# Altium schematic sheet FaultCircuit.SchDoc
size B; DrawnBy: MYazici
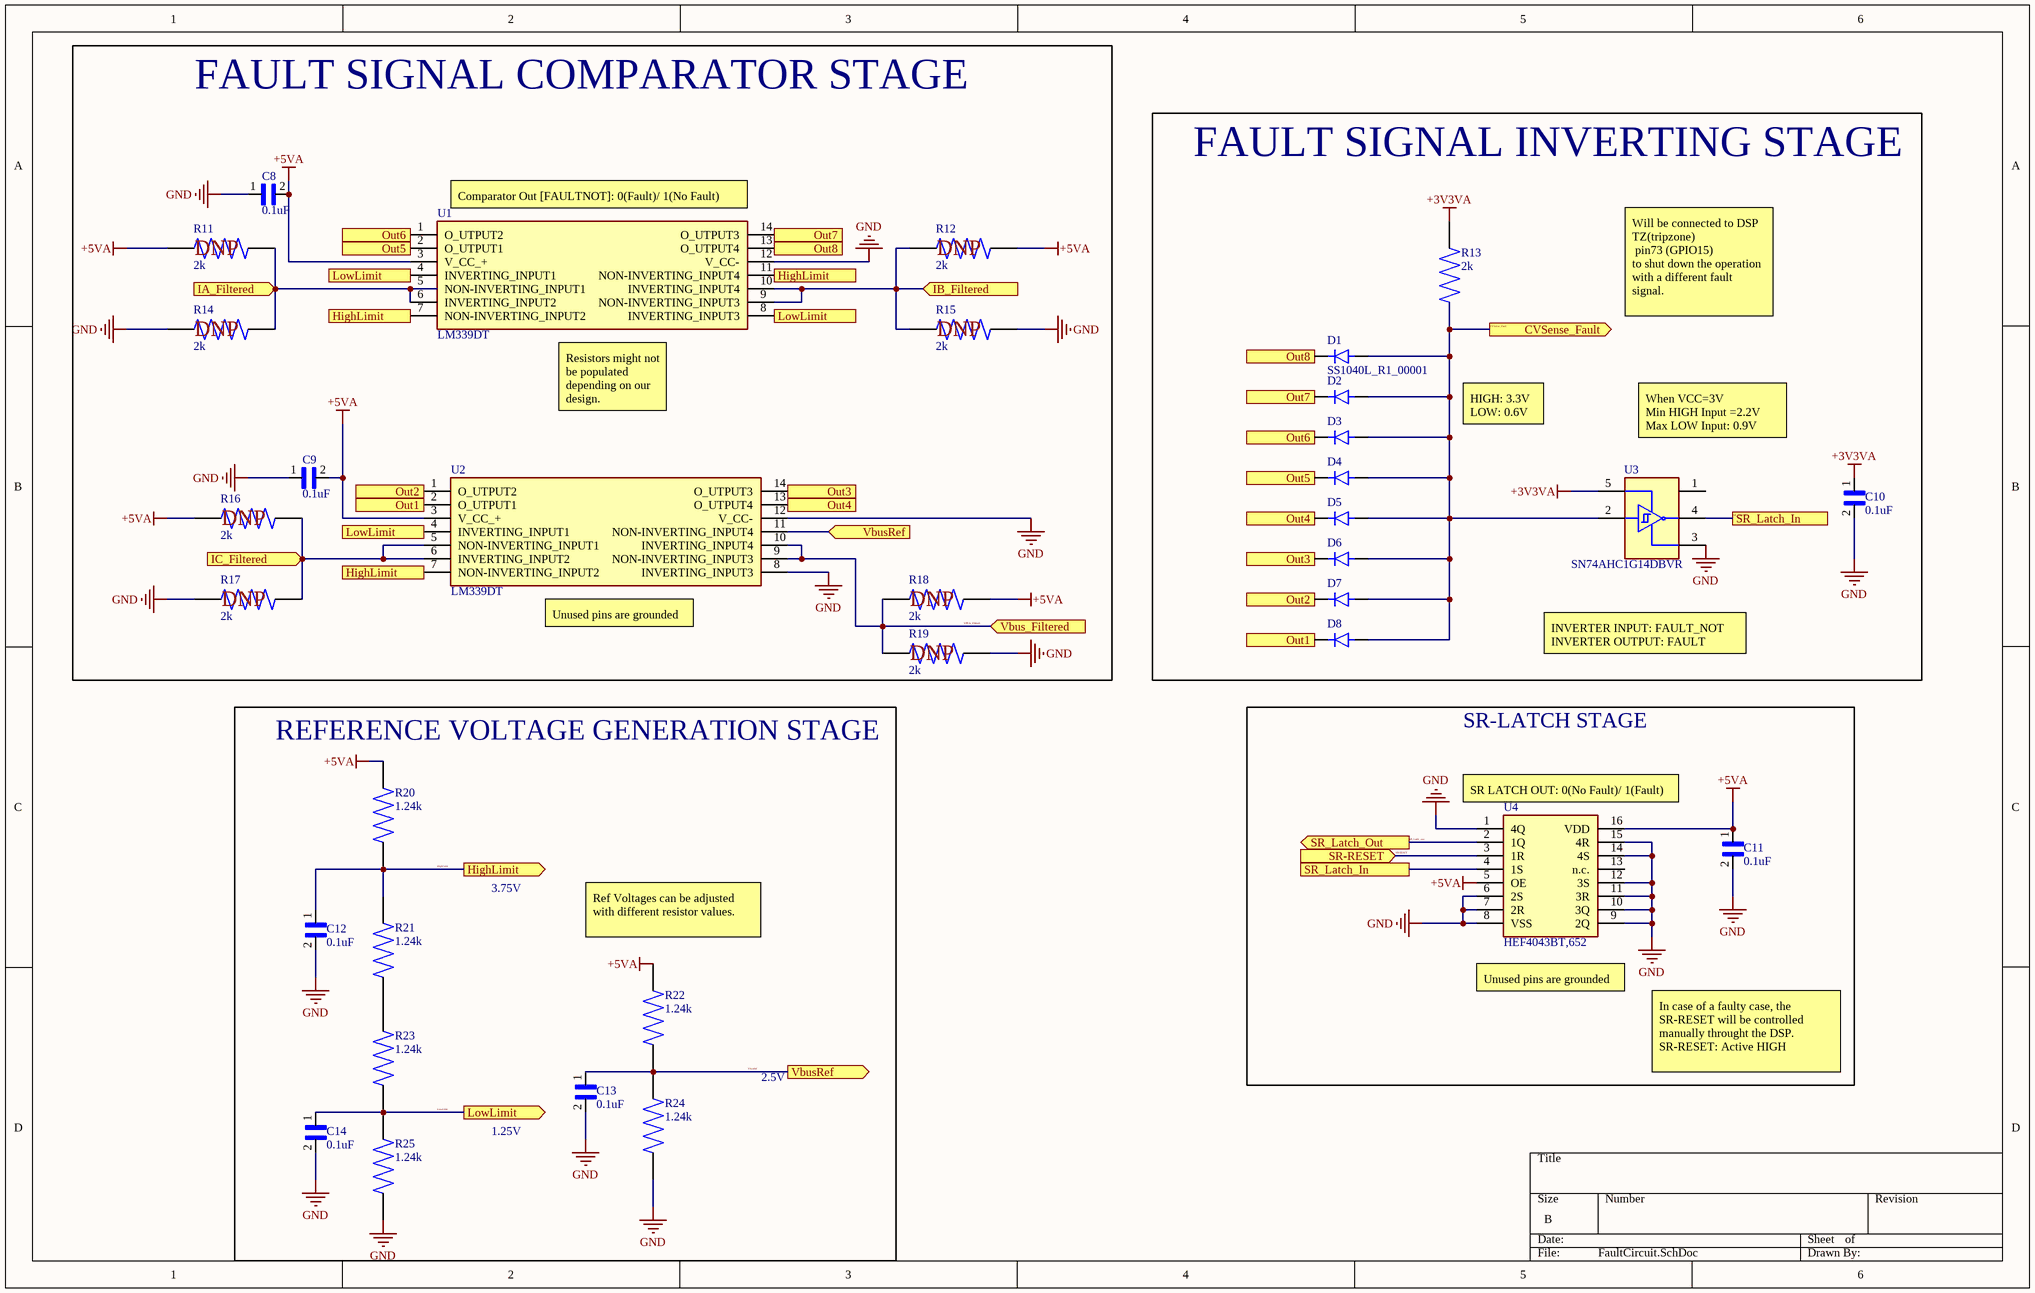
[diagram p0: FaultCircuit.SchDoc]

## Parts
C8  0.1uF  [CAP 0805(2012 metric)]
C9  0.1uF  [CAP 0805(2012 metric)]
C10  0.1uF  [CAP 0805(2012 metric)]
C11  0.1uF  [CAP 0805(2012 metric)]
C12  0.1uF  [CAP 0805(2012 metric)]
C13  0.1uF  [CAP 0805(2012 metric)]
C14  0.1uF  [CAP 0805(2012 metric)]
D1  SS1040L_R1_00001  [SOD123]
D2  SS1040L_R1_00001  [SOD123]  (value not drawn)
D3  SS1040L_R1_00001  [SOD123]  (value not drawn)
D4  SS1040L_R1_00001  [SOD123]  (value not drawn)
D5  SS1040L_R1_00001  [SOD123]  (value not drawn)
D6  SS1040L_R1_00001  [SOD123]  (value not drawn)
D7  SS1040L_R1_00001  [SOD123]  (value not drawn)
D8  SS1040L_R1_00001  [SOD123]  (value not drawn)
R11  2k  [RES 0805(2012 metric)]
R12  2k  [RES 0805(2012 metric)]
R13  2k  [RES 0805(2012 metric)]
R14  2k  [RES 0805(2012 metric)]
R15  2k  [RES 0805(2012 metric)]
R16  2k  [RES 0805(2012 metric)]
R17  2k  [RES 0805(2012 metric)]
R18  2k  [RES 0805(2012 metric)]
R19  2k  [RES 0805(2012 metric)]
R20  1.24k  [RES 0805(2012 metric)]
R21  1.24k  [RES 0805(2012 metric)]
R22  1.24k  [RES 0805(2012 metric)]
R23  1.24k  [RES 0805(2012 metric)]
R24  1.24k  [RES 0805(2012 metric)]
R25  1.24k  [RES 0805(2012 metric)]
U1  LM339DT  [SOIC127P600X175-14N]
U2  LM339DT  [SOIC127P600X175-14N]
U3  SN74AHC1G14DBVR  [SN74AHC1G14DBVR]
U4  HEF4043BT,652  [SOIC127P600X175-16N]

## Blocks framed on the sheet
FAULT SIGNAL COMPARATOR STAGE: C8 C9 R11 R12 R14-R19 U1 U2
FAULT SIGNAL INVERTING STAGE: C10 D1-D8 R13 U3
REFERENCE VOLTAGE GENERATION STAGE: C12-C14 R20-R25
SR-LATCH STAGE: C11 U4

## Ports
CVSense_Fault (out), HighLimit (in), HighLimit (out), IA_Filtered (in), IB_Filtered (in), IC_Filtered (in), LowLimit (in), LowLimit (out), Out1 (in), Out1 (out), Out2 (in), Out2 (out), Out3 (in), Out3 (out), Out4 (in), Out4 (out), Out5 (in), Out5 (out), Out6 (in), Out6 (out), Out7 (in), Out7 (out), Out8 (in), Out8 (out), SR-RESET (in), SR_Latch_In, SR_Latch_Out (out), Vbus_Filtered (in), VbusRef (in), VbusRef (out)

## Nets
+3V3VA: C10.1 R13.2 U3.5(VCC)
+5VA: C8.2 C9.2 C11.1 R11.1 R12.2 R16.1 R18.2 R20.2 R22.2 U1.3(V_CC_+) U2.3(V_CC_+) U4.5(OE) U4.16(VDD)
GND: C8.1 C9.1 C10.2 C11.2 C12.2 C13.2 C14.2 R14.1 R15.2 R17.1 R19.2 R24.1 R25.1 U1.12(V_CC-) U2.8(INVERTING_INPUT3) U2.12(V_CC-) U3.3(GND) U4.1(4Q) U4.6(2S) U4.7(2R) U4.8(VSS) U4.9(2Q) U4.10(3Q) U4.11(3R) U4.12(3S) U4.14(4S) U4.15(4R)
CVSense_Fault: D1.2(Anode) D2.2(Anode) D3.2(Anode) D4.2(Anode) D5.2(Anode) D6.2(Anode) D7.2(Anode) D8.2(Anode) R13.1 U3.2(A) ; port CVSense_Fault
HighLimit: C12.1 R20.1 R21.2 U1.7(NON-INVERTING_INPUT2) U1.11(NON-INVERTING_INPUT4) U2.7(NON-INVERTING_INPUT2) ; port HighLimit
IA_Filtered: R11.2 R14.2 U1.5(NON-INVERTING_INPUT1) U1.6(INVERTING_INPUT2) ; port IA_Filtered
IB_Filtered: R12.1 R15.1 U1.9(NON-INVERTING_INPUT3) U1.10(INVERTING_INPUT4) ; port IB_Filtered
IC_Filtered: R16.2 R17.2 U2.5(NON-INVERTING_INPUT1) U2.6(INVERTING_INPUT2) ; port IC_Filtered
LowLimit: C14.1 R23.1 R25.2 U1.4(INVERTING_INPUT1) U1.8(INVERTING_INPUT3) U2.4(INVERTING_INPUT1) ; port LowLimit
Out1: D8.1(Cathode) U2.2(O_UTPUT1) ; port Out1
Out2: D7.1(Cathode) U2.1(O_UTPUT2) ; port Out2
Out3: D6.1(Cathode) U2.14(O_UTPUT3) ; port Out3
Out4: D5.1(Cathode) U2.13(O_UTPUT4) ; port Out4
Out5: D4.1(Cathode) U1.2(O_UTPUT1) ; port Out5
Out6: D3.1(Cathode) U1.1(O_UTPUT2) ; port Out6
Out7: D2.1(Cathode) U1.14(O_UTPUT3) ; port Out7
Out8: D1.1(Cathode) U1.13(O_UTPUT4) ; port Out8
SR-RESET: U4.3(1R) ; port SR-RESET
SR_Latch_In: U3.4(Y) U4.4(1S) ; port SR_Latch_In
SR_Latch_out: U4.2(1Q) ; port SR_Latch_Out
VBUS_FIltered: R18.1 R19.1 U2.9(NON-INVERTING_INPUT3) U2.10(INVERTING_INPUT4) ; port Vbus_Filtered
VbusRef: C13.1 R22.1 R24.2 U2.11(NON-INVERTING_INPUT4) ; port VbusRef
NetR21_1: R21.1 R23.2

Not connected (* = marked no-connect by the designer): U3 1(NC); U4 13(n.c.)

## Notes on the sheet
- (near U1) Comparator Out [FAULTNOT]: 0(Fault)/ 1(No Fault)
- (near R11) DNP
- (near R12) DNP
- (near R14) DNP
- (near R15) DNP
- Will be connected to DSP TZ(tripzone)
  pin73 (GPIO15)
  to shut down the operation with a different fault signal.
- (near U1) Resistors might not be populated depending on our design.
- HIGH: 3.3V LOW: 0.6V
- When VCC=3V
  Min HIGH Input =2.2V
  Max LOW Input: 0.9V
- (near R16) DNP
- (near R17) DNP
- (near U2) Unused pins are grounded
- (near R18) DNP
- (near R19) DNP
- INVERTER INPUT: FAULT_NOT
  INVERTER OUTPUT: FAULT
- (near U4) SR LATCH OUT: 0(No Fault)/ 1(Fault)
- 3.75V
- Ref Voltages can be adjusted with different resistor values.
- (near U4) Unused pins are grounded
- 2.5V
- In case of a faulty case, the SR-RESET will be controlled manually throught the DSP.
  SR-RESET: Active HIGH
- 1.25V

## Library data of the parts
C8-C14 = 0.1uF: 0.1µF ±10% 25V Ceramic Capacitor X7R 0805
R11-R19 = 2k 0.1W: 2 kOhms ±1% 0.1W, 1/10W Chip Resistor 0603 (1608 Metric) Moisture Resistant Thick Film
R20-R25 = 1.24k 0805
U1 U2 = LM339DT: Integrated Circuit; Manufacturer_Name: STMicroelectronics; Datasheet Link: http://www.st.com/st-web-ui/static/active/en/resource/technical/document/datasheet/CD00000460.pdf; Height: 1.75mm; Manufacturer_Part_Number: LM339DT; Mouser Part Number: 511-LM339DT; Mouser Price/Stock: https://www.mouser.co.uk/ProductDetail/STMicroelectronics/LM339DT?qs=8q6yV%252BexmWU1LP6UrPvZEQ%3D%3D; Arrow Part Number: LM339DT; Arrow Price/Stock: https://www.arrow.com/en/products/lm339dt/stmicroelectronics; Supplier 1: Avnet; Supplier Part Number 1: LM339DTBR2G
U3 = SN74AHC1G14DBVR: Inverter
U4 = HEF4043BT,652: Integrated Circuit; Manufacturer_Name: Nexperia; Datasheet Link: https://assets.nexperia.com/documents/data-sheet/HEF4043B.pdf; Height: 1.75mm; Manufacturer_Part_Number: HEF4043BT,652; Mouser Part Number: 771-HEF4043BT652; Mouser Price/Stock: https://www.mouser.com/Search/Refine.aspx?Keyword=771-HEF4043BT652; Arrow Part Number: HEF4043BT,652; Arrow Price/Stock: https://www.arrow.com/en/products/hef4043bt652/nexperia